# Altium schematic sheet Amplifier_1.SchDoc
size A4
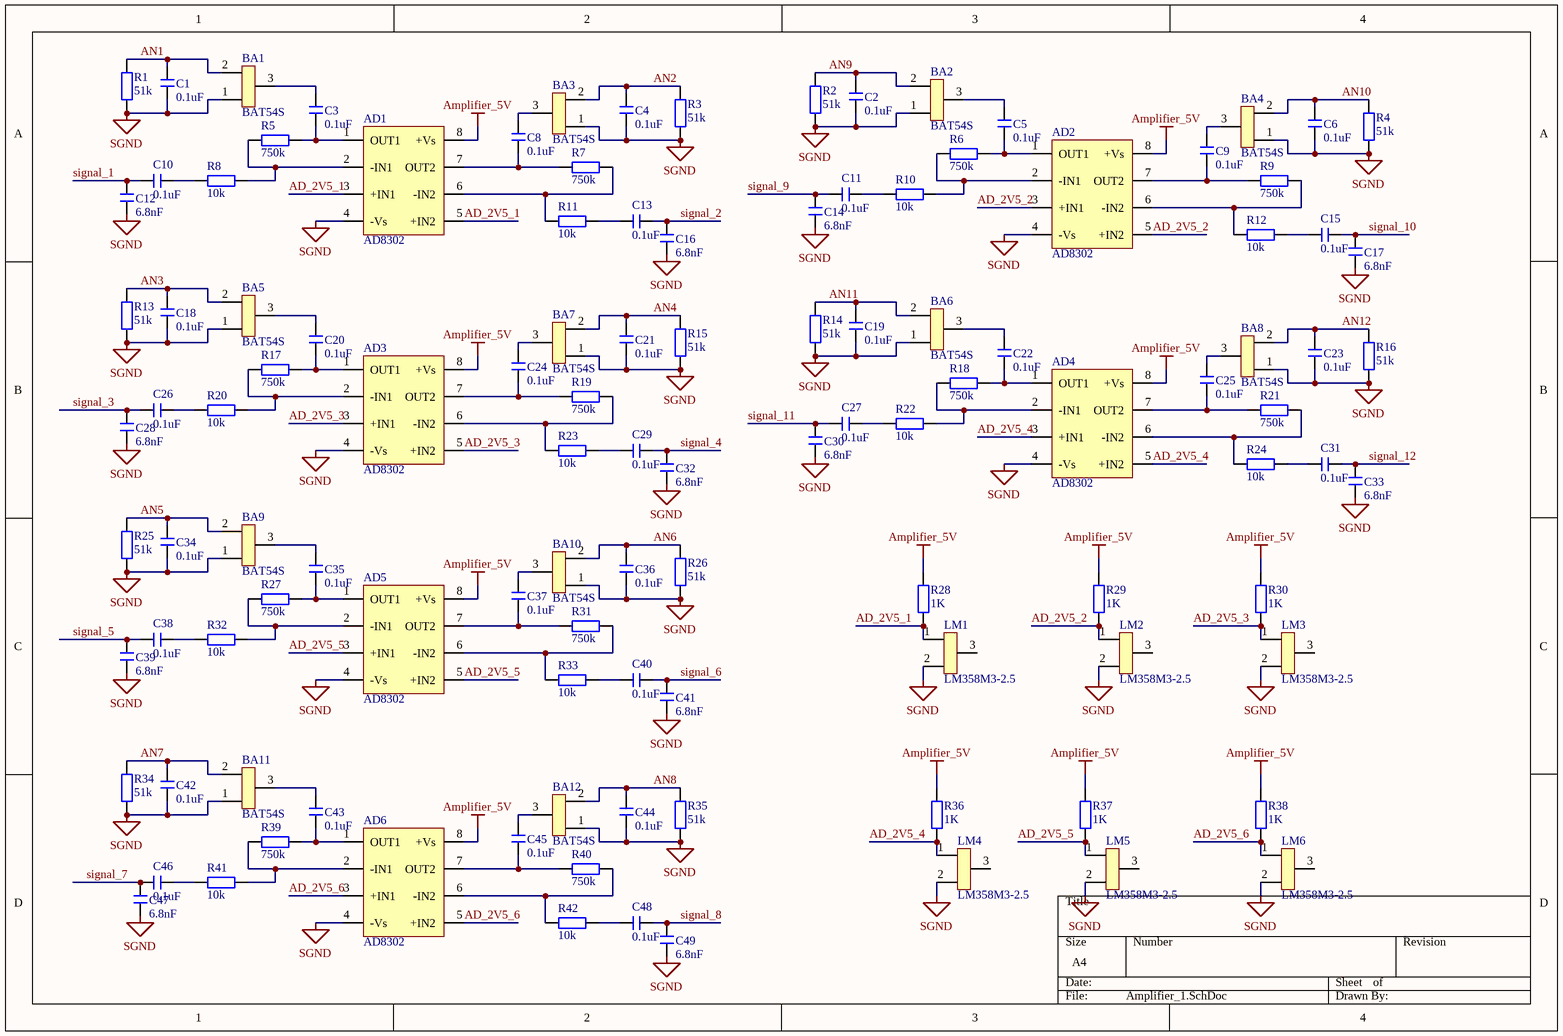
[diagram p0: Amplifier_1.SchDoc]

## Parts
AD1  AD8302  [SOIC-8]
AD2  AD8302  [SOIC-8]
AD3  AD8302  [SOIC-8]
AD4  AD8302  [SOIC-8]
AD5  AD8302  [SOIC-8]
AD6  AD8302  [SOIC-8]
BA1  BAT54S  [SOT23]
BA2  BAT54S  [SOT23]
BA3  BAT54S  [SOT23]
BA4  BAT54S  [SOT23]
BA5  BAT54S  [SOT23]
BA6  BAT54S  [SOT23]
BA7  BAT54S  [SOT23]
BA8  BAT54S  [SOT23]
BA9  BAT54S  [SOT23]
BA10  BAT54S  [SOT23]
BA11  BAT54S  [SOT23]
BA12  BAT54S  [SOT23]
C1  0.1uF  [C 0603_L]
C2  0.1uF  [C 0603_L]
C3  0.1uF  [C 0603_L]
C4  0.1uF  [C 0603_L]
C5  0.1uF  [C 0603_L]
C6  0.1uF  [C 0603_L]
C8  0.1uF  [C 0603_L]
C9  0.1uF  [C 0603_L]
C10  0.1uF  [C 0603_L]
C11  0.1uF  [C 0603_L]
C12  6.8nF  [C 0805_L]
C13  0.1uF  [C 0603_L]
C14  6.8nF  [C 0805_L]
C15  0.1uF  [C 0603_L]
C16  6.8nF  [C 0805_L]
C17  6.8nF  [C 0805_L]
C18  0.1uF  [C 0603_L]
C19  0.1uF  [C 0603_L]
C20  0.1uF  [C 0603_L]
C21  0.1uF  [C 0603_L]
C22  0.1uF  [C 0603_L]
C23  0.1uF  [C 0603_L]
C24  0.1uF  [C 0603_L]
C25  0.1uF  [C 0603_L]
C26  0.1uF  [C 0603_L]
C27  0.1uF  [C 0603_L]
C28  6.8nF  [C 0805_L]
C29  0.1uF  [C 0603_L]
C30  6.8nF  [C 0805_L]
C31  0.1uF  [C 0603_L]
C32  6.8nF  [C 0805_L]
C33  6.8nF  [C 0805_L]
C34  0.1uF  [C 0603_L]
C35  0.1uF  [C 0603_L]
C36  0.1uF  [C 0603_L]
C37  0.1uF  [C 0603_L]
C38  0.1uF  [C 0603_L]
C39  6.8nF  [C 0805_L]
C40  0.1uF  [C 0603_L]
C41  6.8nF  [C 0805_L]
C42  0.1uF  [C 0603_L]
C43  0.1uF  [C 0603_L]
C44  0.1uF  [C 0603_L]
C45  0.1uF  [C 0603_L]
C46  0.1uF  [C 0603_L]
C47  6.8nF  [C 0805_L]
C48  0.1uF  [C 0603_L]
C49  6.8nF  [C 0805_L]
LM1  LM358M3-2.5  [SOT23]
LM2  LM358M3-2.5  [SOT23]
LM3  LM358M3-2.5  [SOT23]
LM4  LM358M3-2.5  [SOT23]
LM5  LM358M3-2.5  [SOT23]
LM6  LM358M3-2.5  [SOT23]
R1  51k  [R 0603_L]
R2  51k  [R 0603_L]
R3  51k  [R 0603_L]
R4  51k  [R 0603_L]
R5  750k  [R 0603_L]
R6  750k  [R 0603_L]
R7  750k  [R 0603_L]
R8  10k  [R 0603_L]
R9  750k  [R 0603_L]
R10  10k  [R 0603_L]
R11  10k  [R 0603_L]
R12  10k  [R 0603_L]
R13  51k  [R 0603_L]
R14  51k  [R 0603_L]
R15  51k  [R 0603_L]
R16  51k  [R 0603_L]
R17  750k  [R 0603_L]
R18  750k  [R 0603_L]
R19  750k  [R 0603_L]
R20  10k  [R 0603_L]
R21  750k  [R 0603_L]
R22  10k  [R 0603_L]
R23  10k  [R 0603_L]
R24  10k  [R 0603_L]
R25  51k  [R 0603_L]
R26  51k  [R 0603_L]
R27  750k  [R 0603_L]
R28  1K  [R 0603_L]
R29  1K  [R 0603_L]
R30  1K  [R 0603_L]
R31  750k  [R 0603_L]
R32  10k  [R 0603_L]
R33  10k  [R 0603_L]
R34  51k  [R 0603_L]
R35  51k  [R 0603_L]
R36  1K  [R 0603_L]
R37  1K  [R 0603_L]
R38  1K  [R 0603_L]
R39  750k  [R 0603_L]
R40  750k  [R 0603_L]
R41  10k  [R 0603_L]
R42  10k  [R 0603_L]

## Nets
Amplifier_5V: AD1.8(+Vs) AD2.8(+Vs) AD3.8(+Vs) AD4.8(+Vs) AD5.8(+Vs) AD6.8(+Vs) R28.1 R29.1 R30.1 R36.1 R37.1 R38.1
SGND: AD1.4(-Vs) AD2.4(-Vs) AD3.4(-Vs) AD4.4(-Vs) AD5.4(-Vs) AD6.4(-Vs) BA1.1 BA2.1 BA3.1 BA4.1 BA5.1 BA6.1 BA7.1 BA8.1 BA9.1 BA10.1 BA11.1 BA12.1 C1.1 C2.1 C4.1 C6.1 C12.1 C14.1 C16.1 C17.1 C18.1 C19.1 C21.1 C23.1 C28.1 C30.1 C32.1 C33.1 C34.1 C36.1 C39.1 C41.1 C42.1 C44.1 C47.1 C49.1 LM1.2 LM2.2 LM3.2 LM4.2 LM5.2 LM6.2 R1.1 R2.1 R3.1 R4.1 R13.1 R14.1 R15.1 R16.1 R25.1 R26.1 R34.1 R35.1
AD_2V5_1: AD1.3(+IN1) AD1.5(+IN2) LM1.1 R28.2
AD_2V5_2: AD2.3(+IN1) AD2.5(+IN2) LM2.1 R29.2
AD_2V5_3: AD3.3(+IN1) AD3.5(+IN2) LM3.1 R30.2
AD_2V5_4: AD4.3(+IN1) AD4.5(+IN2) LM4.1 R36.2
AD_2V5_5: AD5.3(+IN1) AD5.5(+IN2) LM5.1 R37.2
AD_2V5_6: AD6.3(+IN1) AD6.5(+IN2) LM6.1 R38.2
AN1: BA1.2 C1.2 R1.2
AN2: BA3.2 C4.2 R3.2
AN3: BA5.2 C18.2 R13.2
AN4: BA7.2 C21.2 R15.2
AN5: BA9.2 C34.2 R25.2
AN6: BA10.2 C36.2 R26.2
AN7: BA11.2 C42.2 R34.2
AN8: BA12.2 C44.2 R35.2
AN9: BA2.2 C2.2 R2.2
AN10: BA4.2 C6.2 R4.2
AN11: BA6.2 C19.2 R14.2
AN12: BA8.2 C23.2 R16.2
signal_1: C10.1 C12.2
signal_2: C13.2 C16.2
signal_3: C26.1 C28.2
signal_4: C29.2 C32.2
signal_5: C38.1 C39.2
signal_6: C40.2 C41.2
signal_7: C46.1 C47.2
signal_8: C48.2 C49.2
signal_9: C11.1 C14.2
signal_10: C15.2 C17.2
signal_11: C27.1 C30.2
signal_12: C31.2 C33.2
NetAD1_1: AD1.1(OUT1) C3.1 R5.2
NetAD1_2: AD1.2(-IN1) R5.1 R8.2
NetAD1_6: AD1.6(-IN2) R7.2 R11.1
NetAD1_7: AD1.7(OUT2) C8.1 R7.1
NetAD2_1: AD2.1(OUT1) C5.1 R6.2
NetAD2_2: AD2.2(-IN1) R6.1 R10.2
NetAD2_6: AD2.6(-IN2) R9.2 R12.1
NetAD2_7: AD2.7(OUT2) C9.1 R9.1
NetAD3_1: AD3.1(OUT1) C20.1 R17.2
NetAD3_2: AD3.2(-IN1) R17.1 R20.2
NetAD3_6: AD3.6(-IN2) R19.2 R23.1
NetAD3_7: AD3.7(OUT2) C24.1 R19.1
NetAD4_1: AD4.1(OUT1) C22.1 R18.2
NetAD4_2: AD4.2(-IN1) R18.1 R22.2
NetAD4_6: AD4.6(-IN2) R21.2 R24.1
NetAD4_7: AD4.7(OUT2) C25.1 R21.1
NetAD5_1: AD5.1(OUT1) C35.1 R27.2
NetAD5_2: AD5.2(-IN1) R27.1 R32.2
NetAD5_6: AD5.6(-IN2) R31.2 R33.1
NetAD5_7: AD5.7(OUT2) C37.1 R31.1
NetAD6_1: AD6.1(OUT1) C43.1 R39.2
NetAD6_2: AD6.2(-IN1) R39.1 R41.2
NetAD6_6: AD6.6(-IN2) R40.2 R42.1
NetAD6_7: AD6.7(OUT2) C45.1 R40.1
NetBA1_3: BA1.3 C3.2
NetBA2_3: BA2.3 C5.2
NetBA3_3: BA3.3 C8.2
NetBA4_3: BA4.3 C9.2
NetBA5_3: BA5.3 C20.2
NetBA6_3: BA6.3 C22.2
NetBA7_3: BA7.3 C24.2
NetBA8_3: BA8.3 C25.2
NetBA9_3: BA9.3 C35.2
NetBA10_3: BA10.3 C37.2
NetBA11_3: BA11.3 C43.2
NetBA12_3: BA12.3 C45.2
NetC10_2: C10.2 R8.1
NetC11_2: C11.2 R10.1
NetC13_1: C13.1 R11.2
NetC15_1: C15.1 R12.2
NetC26_2: C26.2 R20.1
NetC27_2: C27.2 R22.1
NetC29_1: C29.1 R23.2
NetC31_1: C31.1 R24.2
NetC38_2: C38.2 R32.1
NetC40_1: C40.1 R33.2
NetC46_2: C46.2 R41.1
NetC48_1: C48.1 R42.2

Not connected (* = marked no-connect by the designer): LM1 3; LM2 3; LM3 3; LM4 3; LM5 3; LM6 3

## Library data of the parts
C1-C6 C8-C49 = C: 贴片电容; BOM名称: 无极性贴片电容; 封装库来自淘宝卖家 ID：黄晶宝石: 其他店铺购入均为盗版假冒封装库; 联系卖家，免费查找封装: 唯一出售店铺网址https://shop463601444.taobao.com
R1-R42 = R: 贴片电阻; 封装库来自淘宝卖家 ID：黄晶宝石: 其他店铺购入均为盗版假冒封装库; 联系卖家，免费查找封装: 唯一出售店铺网址https://shop463601444.taobao.com; BOM名称: 贴片电阻